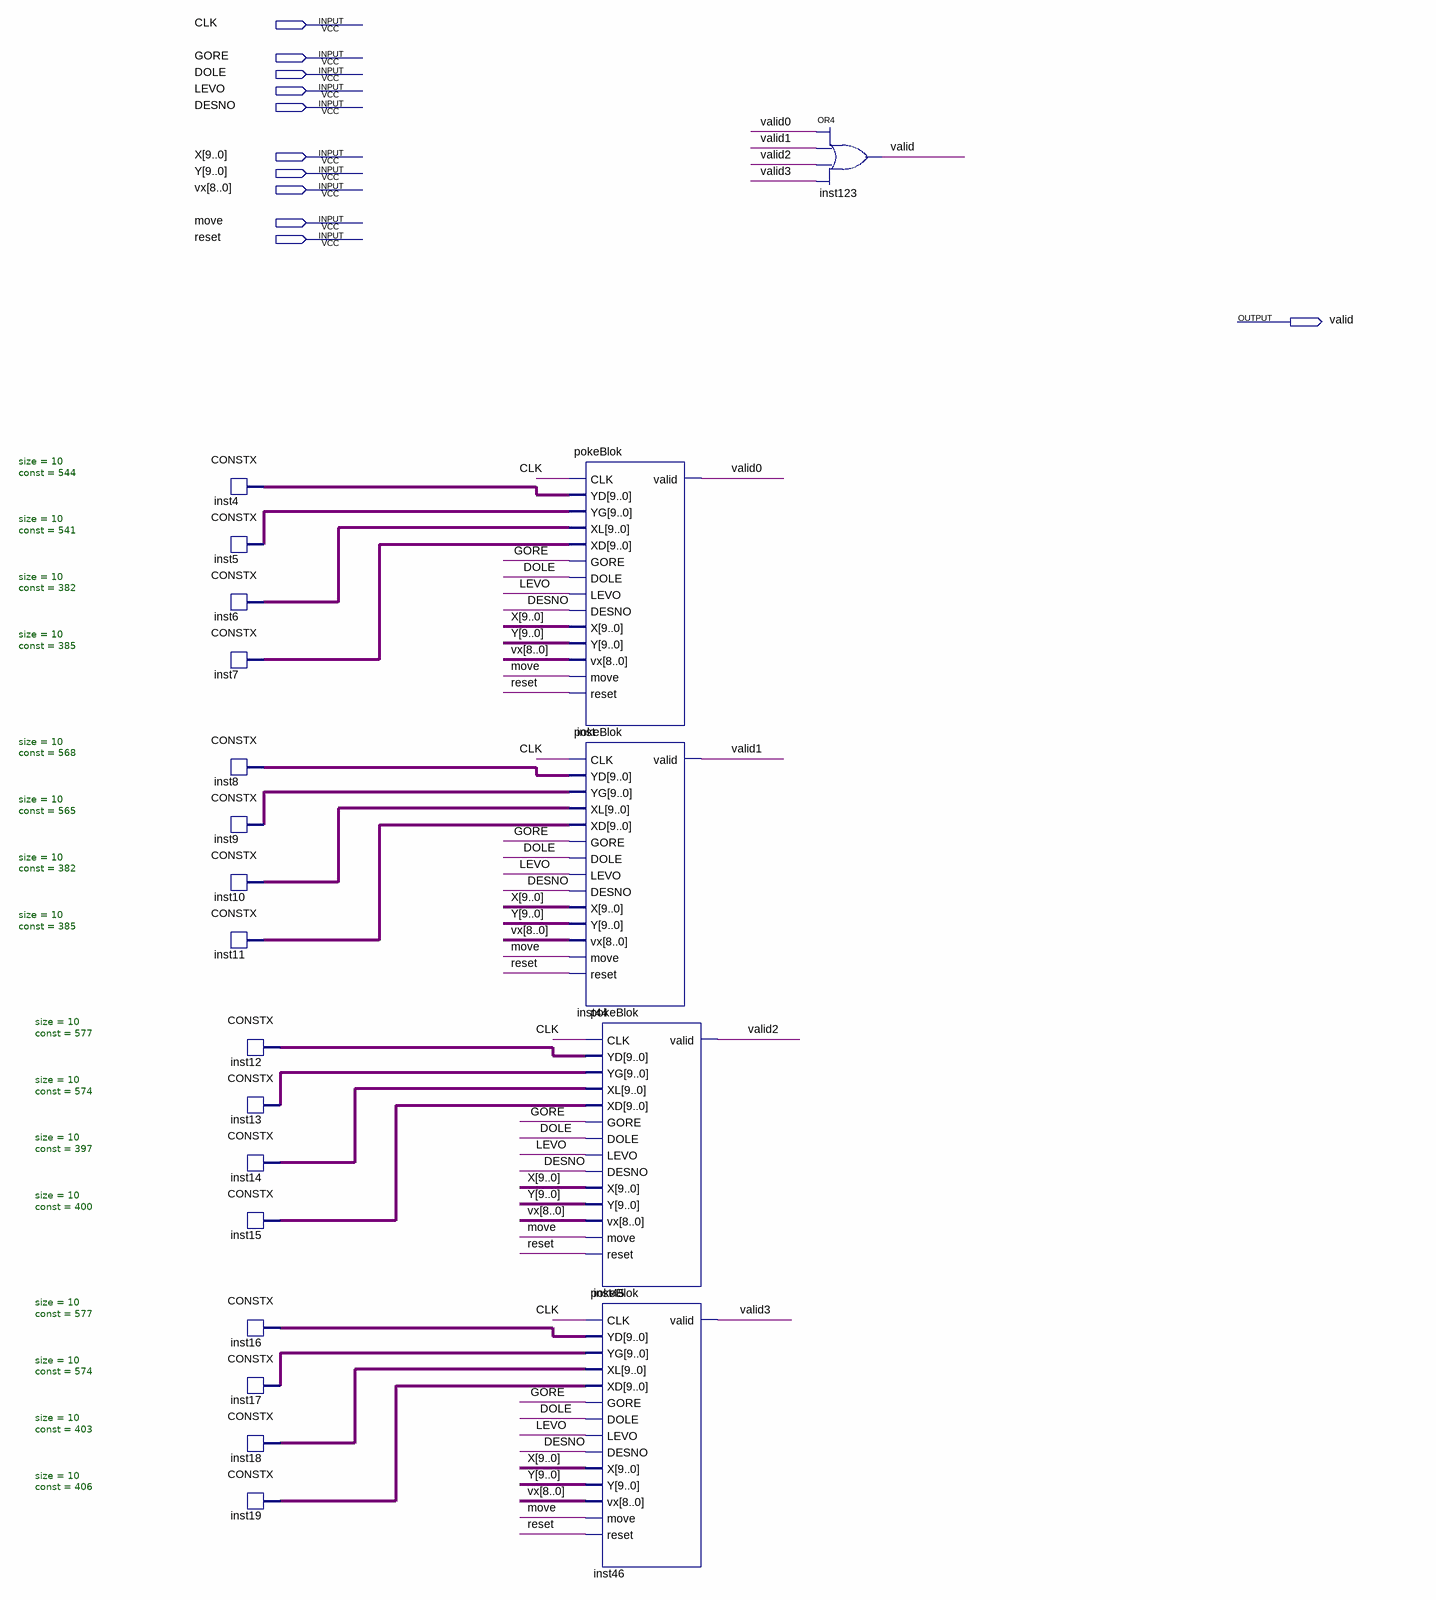
[diagram p0: schematic sheet]
// Quartus schematic beliPokeBlok.bdf as structural Verilog: 21 symbols, 11 pins
module beliPokeBlok (
  input  CLK,
  input  GORE,
  input  DOLE,
  input  LEVO,
  input  DESNO,
  input  [9:0] X,
  input  [9:0] Y,
  input  [8:0] vx,
  input  move,
  input  reset,
  output valid
);

  wire valid0, valid1, valid2, valid3;
  wire [9:0] inst4_data, inst5_data, inst6_data, inst7_data, inst8_data, inst9_data, inst10_data,
       inst11_data, inst12_data, inst13_data, inst14_data, inst15_data, inst16_data, inst17_data,
       inst18_data, inst19_data;

  CONSTX #(.size(10), .\const (544)) inst4 (.data(inst4_data));
  CONSTX #(.size(10), .\const (541)) inst5 (.data(inst5_data));
  CONSTX #(.size(10), .\const (382)) inst6 (.data(inst6_data));
  CONSTX #(.size(10), .\const (385)) inst7 (.data(inst7_data));
  CONSTX #(.size(10), .\const (568)) inst8 (.data(inst8_data));
  CONSTX #(.size(10), .\const (565)) inst9 (.data(inst9_data));
  CONSTX #(.size(10), .\const (382)) inst10 (.data(inst10_data));
  CONSTX #(.size(10), .\const (385)) inst11 (.data(inst11_data));
  CONSTX #(.size(10), .\const (577)) inst12 (.data(inst12_data));
  CONSTX #(.size(10), .\const (574)) inst13 (.data(inst13_data));
  CONSTX #(.size(10), .\const (397)) inst14 (.data(inst14_data));
  CONSTX #(.size(10), .\const (400)) inst15 (.data(inst15_data));
  CONSTX #(.size(10), .\const (577)) inst16 (.data(inst16_data));
  CONSTX #(.size(10), .\const (574)) inst17 (.data(inst17_data));
  CONSTX #(.size(10), .\const (403)) inst18 (.data(inst18_data));
  CONSTX #(.size(10), .\const (406)) inst19 (.data(inst19_data));
  pokeBlok inst (
    .CLK(CLK), .YD(inst4_data), .YG(inst5_data), .XL(inst6_data), .XD(inst7_data), .GORE(GORE), .DOLE(DOLE),
    .LEVO(LEVO), .DESNO(DESNO), .X(X), .Y(Y), .vx(vx), .move(move), .reset(reset), .valid(valid0));
  pokeBlok inst44 (
    .CLK(CLK), .YD(inst8_data), .YG(inst9_data), .XL(inst10_data), .XD(inst11_data), .GORE(GORE),
    .DOLE(DOLE), .LEVO(LEVO), .DESNO(DESNO), .X(X), .Y(Y), .vx(vx), .move(move), .reset(reset), .valid(valid1));
  pokeBlok inst45 (
    .CLK(CLK), .YD(inst12_data), .YG(inst13_data), .XL(inst14_data), .XD(inst15_data), .GORE(GORE),
    .DOLE(DOLE), .LEVO(LEVO), .DESNO(DESNO), .X(X), .Y(Y), .vx(vx), .move(move), .reset(reset), .valid(valid2));
  pokeBlok inst46 (
    .CLK(CLK), .YD(inst16_data), .YG(inst17_data), .XL(inst18_data), .XD(inst19_data), .GORE(GORE),
    .DOLE(DOLE), .LEVO(LEVO), .DESNO(DESNO), .X(X), .Y(Y), .vx(vx), .move(move), .reset(reset), .valid(valid3));
  or inst123 (valid, valid0, valid1, valid2, valid3);
endmodule
